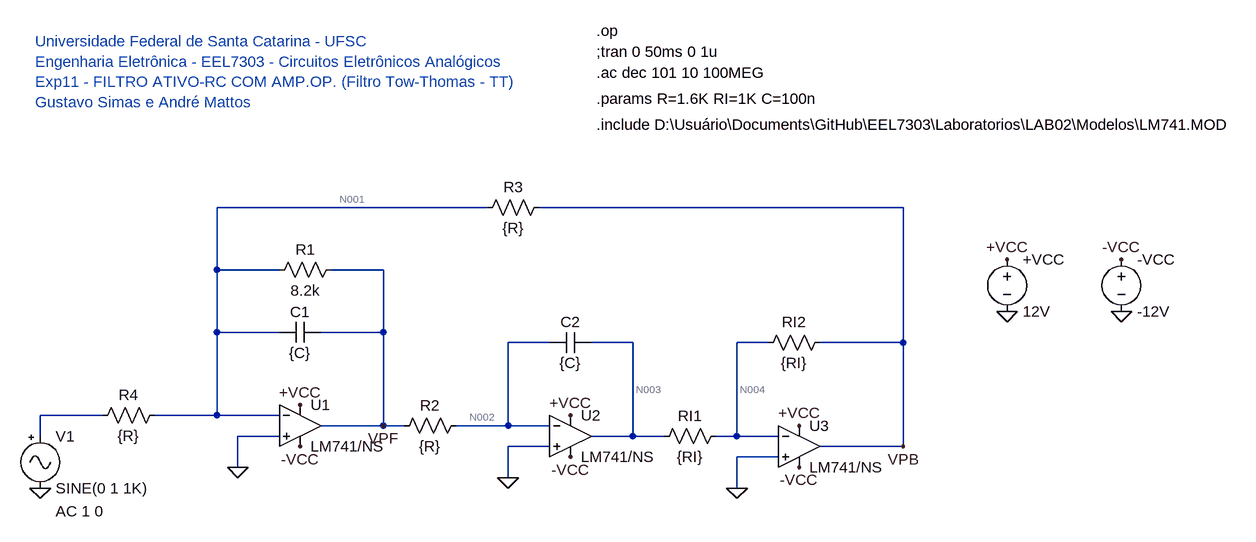
[diagram p0: schematic LAB11.asc]
LAB11.asc, the LTspice schematic file:
Version 4
SHEET 1 2112 1092
WIRE 592 304 176 304
WIRE 1232 304 672 304
WIRE 176 400 176 304
WIRE 272 400 176 400
WIRE 432 400 352 400
WIRE 176 496 176 400
WIRE 272 496 176 496
WIRE 432 496 432 400
WIRE 432 496 336 496
WIRE 688 512 624 512
WIRE 816 512 752 512
WIRE 1024 512 976 512
WIRE 1232 512 1232 304
WIRE 1232 512 1104 512
WIRE 0 624 -96 624
WIRE 176 624 176 496
WIRE 176 624 80 624
WIRE 272 624 176 624
WIRE 432 640 432 496
WIRE 432 640 336 640
WIRE 464 640 432 640
WIRE 624 640 624 512
WIRE 624 640 544 640
WIRE 688 640 624 640
WIRE -96 656 -96 624
WIRE 272 656 208 656
WIRE 816 656 816 512
WIRE 816 656 752 656
WIRE 864 656 816 656
WIRE 976 656 976 512
WIRE 976 656 944 656
WIRE 1040 656 976 656
WIRE 688 672 624 672
WIRE 1232 672 1232 512
WIRE 1232 672 1104 672
WIRE 1040 688 976 688
WIRE 208 704 208 656
WIRE 624 720 624 672
WIRE 976 736 976 688
FLAG 1392 464 0
FLAG 1568 464 0
FLAG 1392 384 +VCC
FLAG 1568 384 -VCC
FLAG 304 608 +VCC
FLAG 304 672 -VCC
FLAG -96 736 0
FLAG 208 704 0
FLAG 720 624 +VCC
FLAG 720 688 -VCC
FLAG 624 720 0
FLAG 1072 640 +VCC
FLAG 1072 704 -VCC
FLAG 976 736 0
FLAG 432 640 VPF
FLAG 1232 672 VPB
SYMBOL Misc\\signal -96 640 R0
WINDOW 123 24 132 Left 2
WINDOW 39 0 0 Left 0
SYMATTR InstName V1
SYMATTR Value2 AC 1 0
SYMBOL Opamps\\opamp2 304 576 R0
SYMATTR InstName U1
SYMATTR Value LM741/NS
SYMBOL voltage 1392 368 R0
WINDOW 123 0 0 Left 0
WINDOW 39 0 0 Left 0
SYMATTR InstName +VCC
SYMATTR Value 12V
SYMBOL voltage 1568 368 R0
WINDOW 123 0 0 Left 0
WINDOW 39 0 0 Left 0
SYMATTR InstName -VCC
SYMATTR Value -12V
SYMBOL res 96 608 R90
WINDOW 0 0 56 VBottom 2
WINDOW 3 32 56 VTop 2
SYMATTR InstName R4
SYMATTR Value {R}
SYMBOL res 560 624 R90
WINDOW 0 0 56 VBottom 2
WINDOW 3 32 56 VTop 2
SYMATTR InstName R2
SYMATTR Value {R}
SYMBOL res 368 384 R90
WINDOW 0 0 56 VBottom 2
WINDOW 3 32 56 VTop 2
SYMATTR InstName R1
SYMATTR Value 8.2k
SYMBOL res 688 288 R90
WINDOW 0 0 56 VBottom 2
WINDOW 3 32 56 VTop 2
SYMATTR InstName R3
SYMATTR Value {R}
SYMBOL Opamps\\opamp2 720 592 R0
SYMATTR InstName U2
SYMATTR Value LM741/NS
SYMBOL Opamps\\opamp2 1072 608 R0
SYMATTR InstName U3
SYMATTR Value LM741/NS
SYMBOL cap 336 480 R90
WINDOW 0 0 32 VBottom 2
WINDOW 3 32 32 VTop 2
SYMATTR InstName C1
SYMATTR Value {C}
SYMBOL cap 752 496 R90
WINDOW 0 0 32 VBottom 2
WINDOW 3 32 32 VTop 2
SYMATTR InstName C2
SYMATTR Value {C}
SYMBOL res 960 640 R90
WINDOW 0 0 56 VBottom 2
WINDOW 3 32 56 VTop 2
SYMATTR InstName RI1
SYMATTR Value {RI}
SYMBOL res 1120 496 R90
WINDOW 0 0 56 VBottom 2
WINDOW 3 32 56 VTop 2
SYMATTR InstName RI2
SYMATTR Value {RI}
TEXT -104 48 Left 2 ;Universidade Federal de Santa Catarina - UFSC\nEngenharia Eletrônica - EEL7303 - Circuitos Eletrônicos Analógicos\nExp11 - FILTRO ATIVO-RC COM AMP.OP. (Filtro Tow-Thomas - TT)\nGustavo Simas e André Mattos
TEXT 760 32 Left 2 !.op
TEXT 760 64 Left 2 !;tran 0 50ms 0 1u
TEXT 760 96 Left 2 !.ac dec 101 10 100MEG
TEXT 760 136 Left 2 !.params R=1.6K RI=1K C=100n
TEXT 760 176 Left 2 !.include D:\\Usuário\\Documents\\GitHub\\EEL7303\\Laboratorios\\LAB02\\Modelos\\LM741.MOD

The netlist it stands for:
* LAB11.asc
V1 N005 0 SINE(0 1 1K) AC 1 0
XU1 0 N001 +VCC -VCC VPF LM741/NS  ; pins In+ In- V+ V- OUT
V§+VCC +VCC 0 12V
V§-VCC -VCC 0 -12V
R4 N001 N005 {R}
R2 N002 VPF {R}
R1 VPF N001 8.2k
R3 VPB N001 {R}
XU2 0 N002 +VCC -VCC N003 LM741/NS  ; pins In+ In- V+ V- OUT
XU3 0 N004 +VCC -VCC VPB LM741/NS  ; pins In+ In- V+ V- OUT
C1 VPF N001 {C}
C2 N003 N002 {C}
RI1 N004 N003 {RI}
RI2 VPB N004 {RI}
* Universidade Federal de Santa Catarina - UFSC
* Engenharia Eletrônica - EEL7303 - Circuitos Eletrônicos Analógicos
* Exp11 - FILTRO ATIVO-RC COM AMP.OP. (Filtro Tow-Thomas - TT)
* Gustavo Simas e André Mattos
.op
;tran 0 50ms 0 1u
.ac dec 101 10 100MEG
.params R=1.6K RI=1K C=100n
.include D:\Usuário\Documents\GitHub\EEL7303\Laboratorios\LAB02\Modelos\LM741.MOD
.backanno
.end

* Results of the author's LTspice run, read from the files saved beside the schematic
* Operating Point, zero values left out:
*   V(n001) = 1 mV
*   V(-vcc) = -12 V
*   V(+vcc) = 12 V
*   V(vpf) = 1.163 mV
*   V(n002) = 1 mV
*   V(vpb) = 2.131 mV
*   V(n003) = -29.33 µV
*   V(n004) = 1 mV
*   I(Ri2) = 1.131 µA
*   I(Ri1) = 1.029 µA
*   I(R3) = 707 nA
*   I(R1) = 19.88 nA
*   I(R2) = -101.9 nA
*   I(R4) = 625 nA
*   I(-vcc) = 4.878 mA
*   I(+vcc) = -4.879 mA
*   I(V1) = 625 nA
*   Ix(u1:1) = 57.86 nA
*   Ix(u1:2) = 101.9 nA
*   Ix(u1:99) = 1.626 mA
*   Ix(u1:50) = -1.626 mA
*   Ix(u1:28) = -121.7 nA
*   Ix(u2:1) = 57.86 nA
*   Ix(u2:2) = 101.9 nA
*   Ix(u2:99) = 1.626 mA
*   Ix(u2:50) = -1.627 mA
*   Ix(u2:28) = 1.029 µA
*   Ix(u3:1) = 57.86 nA
*   Ix(u3:2) = 101.9 nA
*   Ix(u3:99) = 1.627 mA
*   Ix(u3:50) = -1.625 mA
*   Ix(u3:28) = -1.838 µA
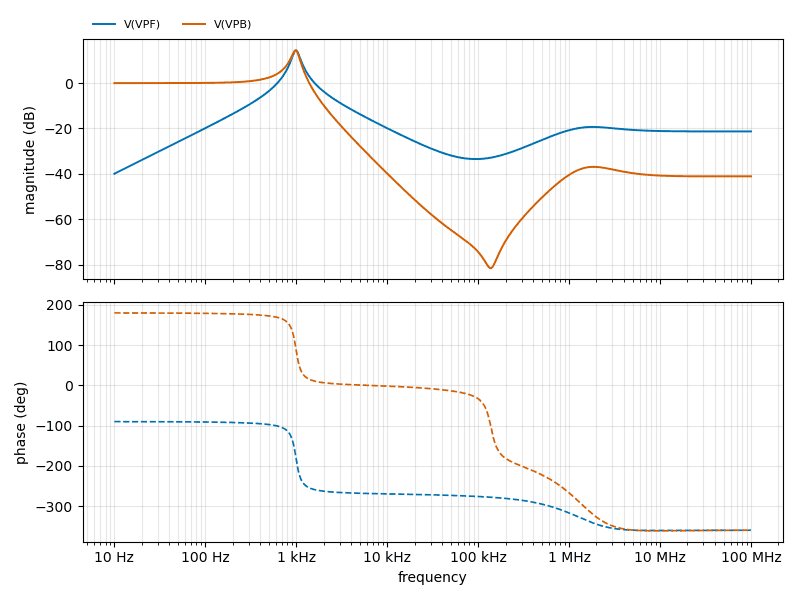
[diagram p1: AC Analysis of LAB11.asc, plotted from the saved traces]
* AC Analysis, 1 run:
*   V(VPF): -39.94 dB at 10 Hz, -21.28 dB at 100 MHz, peak 14.41 dB at 1 kHz, 3 dB below the peak at 902.9 Hz and 1.092 kHz
*   V(VPB): 0.00 dB at 10 Hz, -41.09 dB at 100 MHz, peak 14.45 dB at 977.5 Hz, 3 dB below the peak at 883.7 Hz and 1.075 kHz
* From the log:
*   Semiconductor Device Operating Points:
*                           --- Diodes ---
*   Name:    d:u3:3      d:u3:4      d:u3:6      d:u3:5      d:u3:2
*   Model:    u3:dx       u3:dx       u3:dx       u3:dx       u3:dx
*   Id:     -1.81e-13   -1.81e-13    7.71e-05    7.53e-05   -1.04e-11
*   Vd:     -1.80e-01   -1.80e-01    6.48e-01    6.48e-01   -1.04e+01
*   Req:     1.00e+12    1.00e+12    3.35e+02    3.43e+02    1.00e+12
*   CAP:     0.00e+00    0.00e+00    0.00e+00    0.00e+00    0.00e+00
*   Name:    d:u3:1      d:u2:3      d:u2:4      d:u2:6      d:u2:5
*   Model:    u3:dx       u2:dx       u2:dx       u2:dx       u2:dx
*   Id:     -1.04e-11   -1.81e-13   -1.81e-13    7.57e-05    7.67e-05
*   Vd:     -1.04e+01   -1.80e-01   -1.80e-01    6.48e-01    6.48e-01
*   Req:     1.00e+12    1.00e+12    1.00e+12    3.42e+02    3.37e+02
*   CAP:     0.00e+00    0.00e+00    0.00e+00    0.00e+00    0.00e+00
*   Name:    d:u2:2      d:u2:1      d:u1:3      d:u1:4      d:u1:6
*   Model:    u2:dx       u2:dx       u1:dx       u1:dx       u1:dx
*   Id:     -1.04e-11   -1.04e-11   -1.81e-13   -1.81e-13    7.63e-05
*   Vd:     -1.04e+01   -1.04e+01   -1.80e-01   -1.80e-01    6.48e-01
*   Req:     1.00e+12    1.00e+12    1.00e+12    1.00e+12    3.39e+02
*   CAP:     0.00e+00    0.00e+00    0.00e+00    0.00e+00    0.00e+00
*   Name:    d:u1:5      d:u1:2      d:u1:1
*   Model:    u1:dx       u1:dx       u1:dx
*   Id:      7.62e-05   -1.04e-11   -1.04e-11
*   Vd:      6.48e-01   -1.04e+01   -1.04e+01
*   Req:     3.40e+02    1.00e+12    1.00e+12
*   CAP:     0.00e+00    0.00e+00    0.00e+00
*                           --- Bipolar Transistors ---
*   Name:     q:u3:2      q:u3:1      q:u2:2      q:u2:1      q:u1:2
*   Model:     u3:qx       u3:qx       u2:qx       u2:qx       u1:qx
*   Ib:       7.99e-08    7.99e-08    7.99e-08    7.99e-08    7.99e-08
*   Ic:       4.99e-05    4.99e-05    4.99e-05    4.99e-05    4.99e-05
*   Vbe:      6.97e-01    6.97e-01    6.97e-01    6.97e-01    6.97e-01
*   Vbc:     -1.20e+01   -1.20e+01   -1.20e+01   -1.20e+01   -1.20e+01
*   Vce:      1.27e+01    1.27e+01    1.27e+01    1.27e+01    1.27e+01
*   BetaDC:   6.25e+02    6.25e+02    6.25e+02    6.25e+02    6.25e+02
*   Gm:       1.93e-03    1.93e-03    1.93e-03    1.93e-03    1.93e-03
*   Rpi:      3.24e+05    3.24e+05    3.24e+05    3.24e+05    3.24e+05
*   Rx:       0.00e+00    0.00e+00    0.00e+00    0.00e+00    0.00e+00
*   Ro:       0.00e+00    0.00e+00    0.00e+00    0.00e+00    0.00e+00
*   Cbe:      0.00e+00    0.00e+00    0.00e+00    0.00e+00    0.00e+00
*   Cbc:      0.00e+00    0.00e+00    0.00e+00    0.00e+00    0.00e+00
*   Cjs:      0.00e+00    0.00e+00    0.00e+00    0.00e+00    0.00e+00
*   BetaAC:   6.25e+02    6.25e+02    6.25e+02    6.25e+02    6.25e+02
*   Cbx:      0.00e+00    0.00e+00    0.00e+00    0.00e+00    0.00e+00
*   Ft:       0.00e+00    0.00e+00    0.00e+00    0.00e+00    0.00e+00
*   Name:     q:u1:1
*   Model:     u1:qx
*   Ib:       7.99e-08
*   Ic:       4.99e-05
*   Vbe:      6.97e-01
*   Vbc:     -1.20e+01
*   Vce:      1.27e+01
*   BetaDC:   6.25e+02
*   Gm:       1.93e-03
*   Rpi:      3.24e+05
*   Rx:       0.00e+00
*   Ro:       0.00e+00
*   Cbe:      0.00e+00
*   Cbc:      0.00e+00
*   Cjs:      0.00e+00
*   BetaAC:   6.25e+02
*   Cbx:      0.00e+00
*   Ft:       0.00e+00